# EAGLE design Power-PCB (EAGLE 7.7.0)
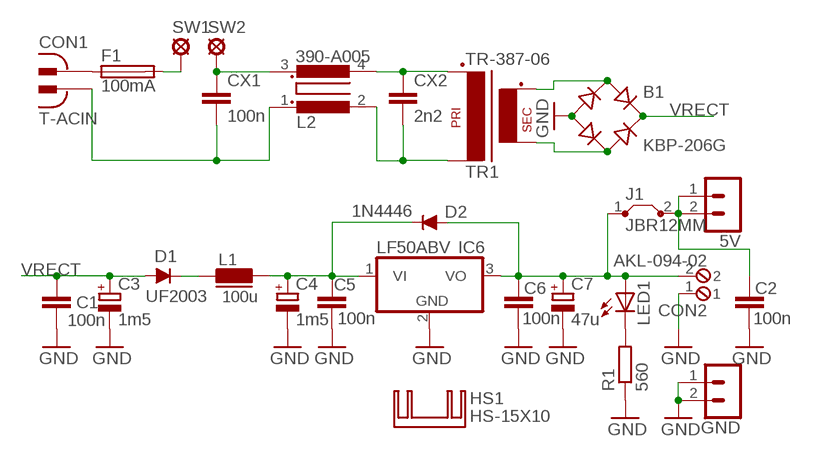
[diagram p0: schematic, sheet 1]

## Parts
5V  MA02-1  [MA02-1]
B1  KBP-206G  RECTIFIER-2KBP  [2KBP]
C1  100n  C-EU050-024X044  [C050-024X044]
C2  100n  C-EU050-024X044  [C050-024X044]
C3  1m5  CPOL-EUE5-10.5  [E5-10,5]
C4  1m5  CPOL-EUE5-10.5  [E5-10,5]
C5  100n  C-EU050-024X044  [C050-024X044]
C6  100n  C-EU050-024X044  [C050-024X044]
C7  47u  CPOL-EUE2.5-6  [E2,5-6]
CON1  T-ACIN  [TECHNICS-ACIN1]
CON2  AKL-094-02  [AKL-094-02]
CX1  100n  CXXC15B6  [XC15B6]
CX2  2n2  C-EU075-032X103  [C075-032X103]
D1  UF2003  DIODE-DO41-10A  [DO41-10A]
D2  1N4446  [DO35-10]
F1  100mA  FUSEKS9V  [KS9V]
GND  MA02-1  [MA02-1]
HS1  HS-15X10  [HEATSINK-TO220-15X10X21]
IC6  LF50ABV  7805TV  [TO220V]
J1  JBR12MM  JUMPER-BRIGDE12MM  [12-THICK-WIRE]
L1  100u  07HCP  [07HCP]
L2  390-A005  [390-A005]
LED1  LED5MM  [LED5MM]
R1  560  R-EU_0207/10  [0207/10]
SW1  SE13  [SE13]
SW2  SE13  [SE13]
TR1  TR-387-06  [TRAFO-GERTH-387-06]

## Nets
GND: B1.- C1.2 C2.2 C3.- C4.- C5.2 C6.2 C7.- CON2.1 GND.1 GND.2 IC6.2(GND) R1.1
N$1: CON1.1 F1.1
N$2: CX1.1 L2.3 SW2.MP
N$3: CON1.2 CX1.2 L2.1
N$4: F1.2 SW1.MP
N$5 [Stromversorgung]: C4.+ C5.1 D2.C IC6.1(VI) L1.2
N$6: CX2.1 L2.4 TR1.P2
N$7: CX2.2 L2.2 TR1.P1
N$8: B1.AC1 TR1.S2
N$9: B1.AC2 TR1.S1
N$10: LED1.K(C) R1.2
N$11: D1.C L1.1
N$12: C6.1 C7.+ CON2.2 D2.A IC6.3(VO) J1.1 LED1.A
N$13: 5V.1 5V.2 C2.1 J1.2
VRECT: B1.+ C1.1 C3.+ D1.A

## Library data of the parts
5V GND = tj-library:MA02-1: PIN HEADER
B1 = rectifier:RECTIFIER-: Rectifier
C1 C2 C5 C6 CX2 = rcl:C-EU: CAPACITOR, European symbol
C3 C4 C7 = rcl:CPOL-EU: POLARIZED CAPACITOR, European symbol
CON1 = tj-library:T-ACIN: TECHNICS AC Power Connector (ex. ST-G570)
CON2 = tj-library:AKL-094-02: Riacon AKL-094, Raster 5.08 mm, Polzahl 2
CX1 = rcl:CX: X CAPACITOR for power line
D1 = diode:DIODE-: DIODE
D2 = diode:1N4446: DIODE high speed (Philips)
F1 = fuse:FUSE: Fuse; OC_FARNELL: unknown; OC_NEWARK: unknown
HS1 = tj-library:HS-15X10: Heat Sink TO-220 (China, B:15mm x T:10mm x H:21mm)
IC6 = linear:78*: Positive VOLTAGE REGULATOR Source: http://cache.national.com/ds/LM/LM78L05.pdf http://www.fairchildsemi.com/ds/LM/LM7805.pdf
J1 = tj-library:JUMPER-BRIGDE: Bridge for thick wire (up to 1.35mm)
L1 = inductor-fastron:07HCP: Fastron Inductor 07HCP
L2 = tj-library:390-A005: Common Mode Choke (Ex switching Power Supply, 6...10mH, ca. 400mA)
LED1 = led:LED: LED OSRAM: - CHIPLED LG R971, LG N971, LY N971, LG Q971, LY Q971, LO R971, LY R971 LH N974, LH R974 LS Q976, LO Q976, LY Q976 LO Q996 - Hyper CHIPLED LW Q18S LB Q993, LB Q99A, LB R99A - SideLED LS A670, LO A670, LY A670, LG A670, LP A670 LB A673, LV A673, LT A673, LW A673 LH A674 LY A675 LS A676, LA A676, LO A676, LY A676, LW A676 LS A679, LY A679, LG A679 - Hyper Micro SIDELED® LS Y876, LA Y876, LO Y876, LY Y876 LT Y87S - SmartLED LW L88C, LW L88S LB L89C, LB L89S, LG L890 LS L89K, LO L89K, LY L89K LS L896, LA L896, LO L896, LY L896 - TOPLED LS T670, LO T670, LY T670, LG T670, LP T670 LSG T670, LSP T670, LSY T670, LOP T670, LYG T670 LG T671, LOG T671, LSG T671 LB T673, LV T673, LT T673, LW T673 LH T674 LS T676, LA T676, LO T676, LY T676, LB T676, LH T676, LSB T676, LW T676 LB T67C, LV T67C, LT T67C, LS T67K, LO T67K, LY T67K, LW E67C LS E67B, LA E67B, LO E67B, LY E67B, LB E67C, LV E67C, LT E67C LW T67C LS T679, LY T679, LG T679 LS T770, LO T770, LY T770, LG T770, LP T770 LB T773, LV T773, LT T773, LW T773 LH T774 LS E675, LA E675, LY E675, LS T675 LS T776, LA T776, LO T776, LY T776, LB T776 LHGB T686 LT T68C, LB T68C - Hyper Mini TOPLED® LB M676 - Mini TOPLED Santana® LG M470 LS M47K, LO M47K, LY M47K Source: http://www.osram.convergy.de LUXEON: - LUMILED® LXK2-PW12-R00, LXK2-PW12-S00, LXK2-PW14-U00, LXK2-PW14-V00 LXK2-PM12-R00, LXK2-PM12-S00, LXK2-PM14-U00 LXK2-PE12-Q00, LXK2-PE12-R00, LXK2-PE12-S00, LXK2-PE14-T00, LXK2-PE14-U00 LXK2-PB12-K00, LXK2-PB12-L00, LXK2-PB12-M00, LXK2-PB14-N00, LXK2-PB14-P00, LXK2-PB14-Q00 LXK2-PR12-L00, LXK2-PR12-M00, LXK2-PR14-Q00, LXK2-PR14-R00 LXK2-PD12-Q00, LXK2-PD12-R00, LXK2-PD12-S00 LXK2-PH12-R00, LXK2-PH12-S00 LXK2-PL12-P00, LXK2-PL12-Q00, LXK2-PL12-R00 Source: www.luxeon.com KINGBRIGHT: KA-3528ASYC Source: www.kingbright.com
R1 = rcl:R-EU_: RESISTOR, European symbol
SW1 SW2 = solpad:SE13: SOLDER PAD E1542, drill 1,3mm, distributor Buerklin, 07F815
TR1 = tj-library:TR-387-06: Transformator Gerth 387.06, 3.6VA

## Net classes
0 default: width 0.406 mm, clearance 0.406 mm
1 Stromversorgung: width 0.406 mm, clearance 0.406 mm
2 Stromversorgung 2: width 1.422 mm, clearance 0.61 mm

## Board
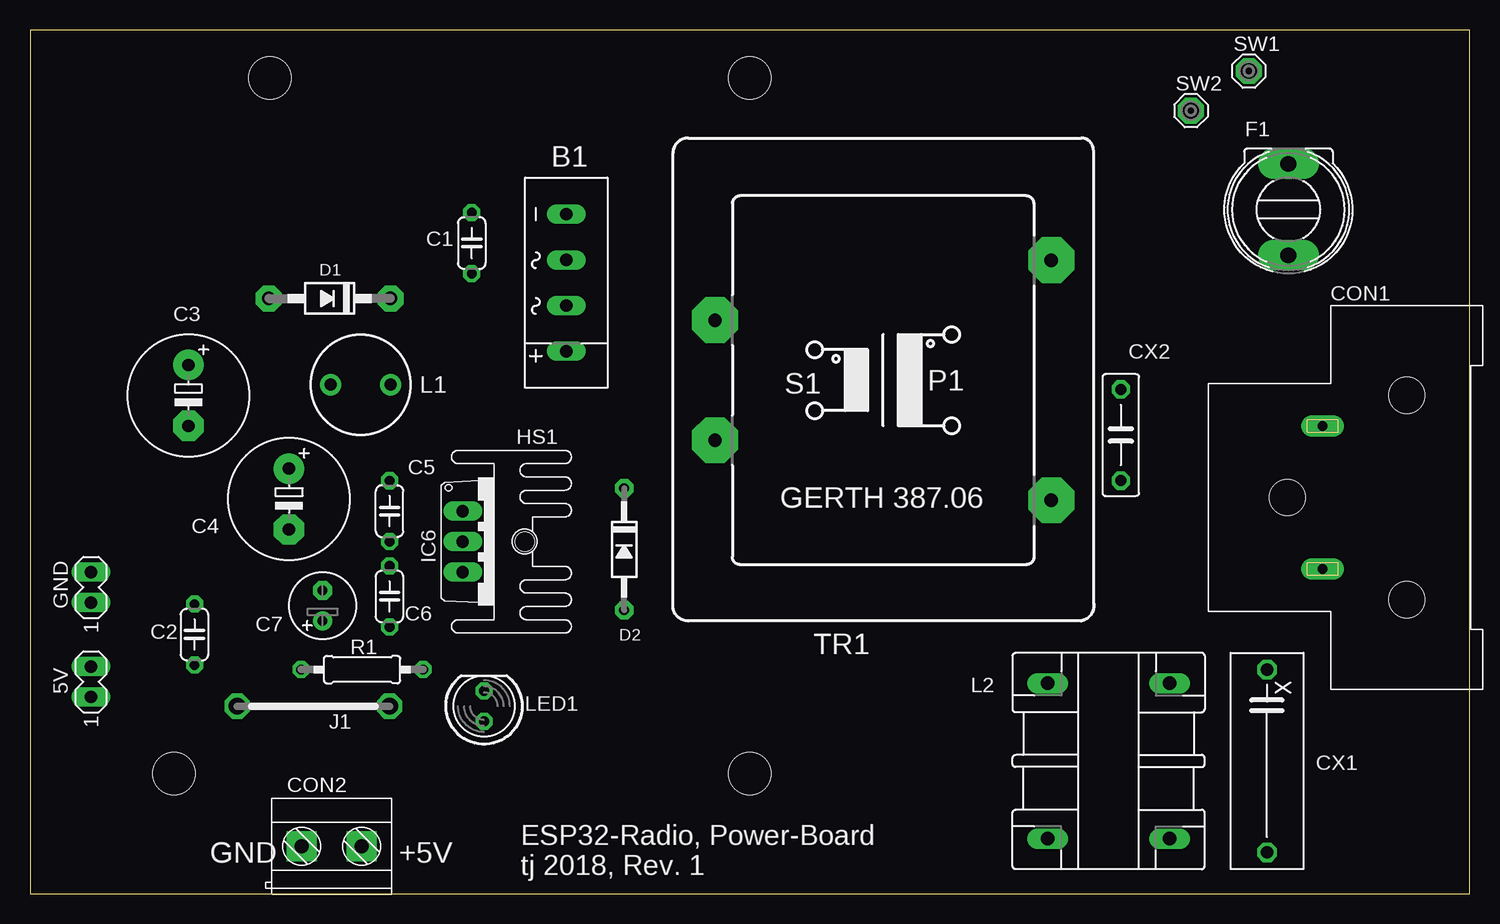
[diagram p1: board, top side]
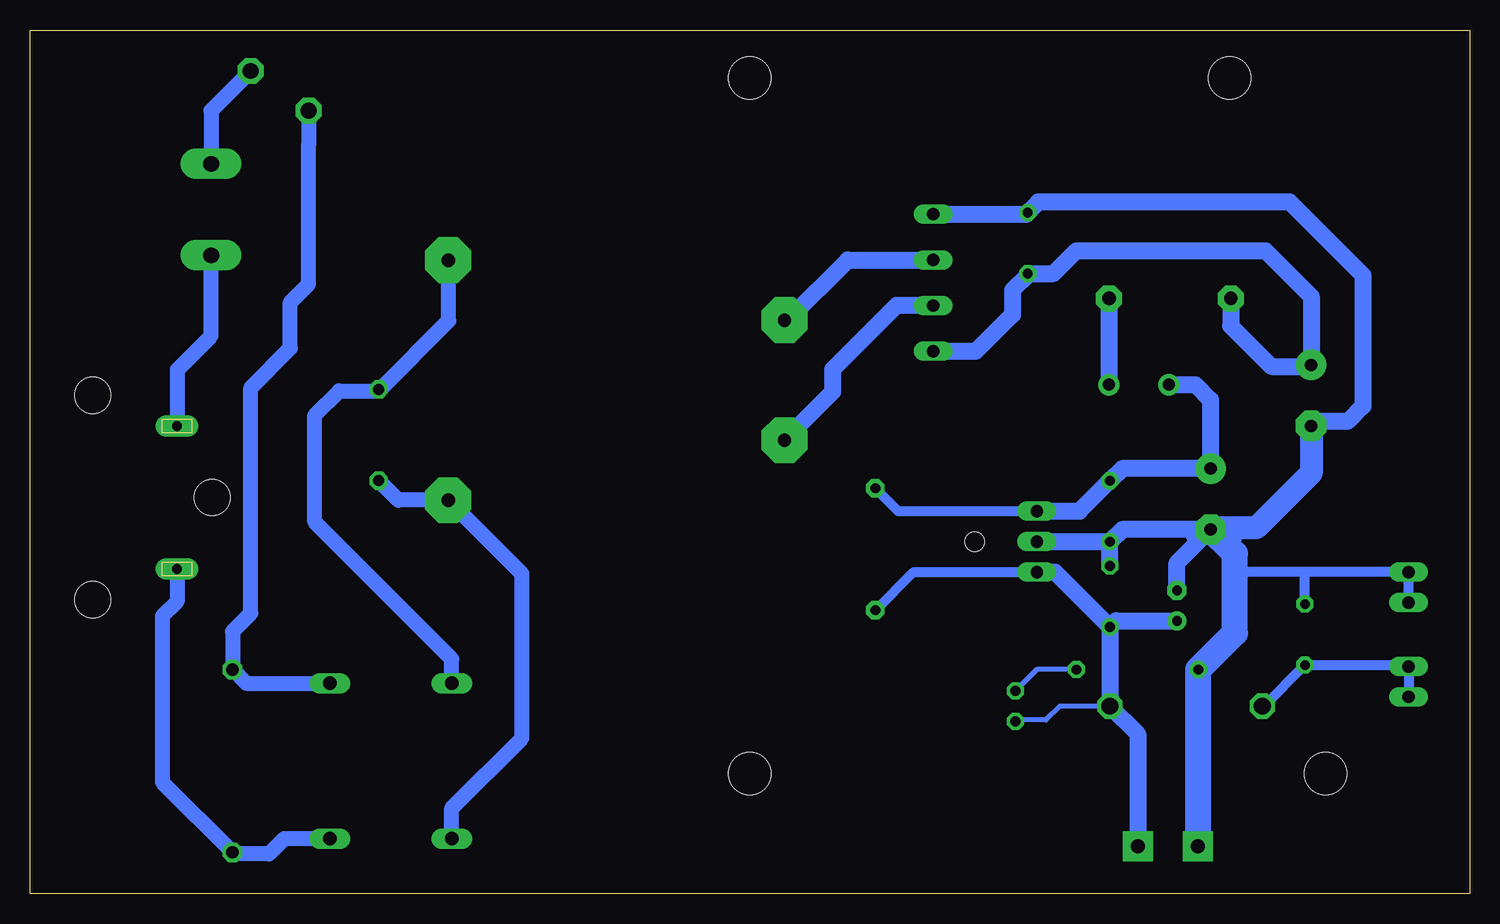
[diagram p2: board, bottom side, seen from below]

Size 120 x 72 mm. Coordinates in mm from the lower left corner, seen from the top.
Outline: 0,0 120,0 120,72 0,72 0,0
Copper layers (1*16): Top 0.035mm / dielectric 1.5mm / Bottom 0.035mm
Design rules "default *": minimum track width 10mil, minimum drill 24mil, track to track 8mil, track to pad 8mil, pad to pad 8mil, via to via 8mil, smd to smd 8mil, copper to edge 16mil, drill to drill 8mil, minimum pad ring 12mil, minimum via ring 10mil, stop-mask expansion 4mil, vias tented up to drill 0mil, thermal gap 10mil
Holes 3.5 mm at 20,68 60,68 12,10 60,10
tRestrict: area 18.2,66.2 to 21.8,69.8; area 58.2,66.2 to 61.8,69.8; area 10.2,8.2 to 13.8,11.8; area 58.2,8.2 to 61.8,11.8
bRestrict: area 18.2,66.2 to 21.8,69.8; area 58.2,66.2 to 61.8,69.8; area 10.2,8.2 to 13.8,11.8; area 58.2,8.2 to 61.8,11.8
vRestrict: area 18.2,66.2 to 21.8,69.8; area 58.2,66.2 to 61.8,69.8; area 10.2,8.2 to 13.8,11.8; area 58.2,8.2 to 61.8,11.8

### Footprints (pad centres in the part's own frame; a part is rotated, then mirrored left to right if it is on the bottom)
MA02-1 = drill 1.016 long: 1 -1.27,0; 2 1.27,0
2KBP = drill 1.016 long: + 5.715,0; - -5.715,0; AC1 -1.905,0; AC2 1.905,0
C050-024X044 = drill 0.813 octagon: 1 -2.54,0; 2 2.54,0
E5-10,5 = drill 1.016 pad 2.54: + -2.54,0 | drill 1.016 pad 2.54 octagon: - 2.54,0
E2,5-6 = drill 0.813 pad 1.6: + -1.27,0 | drill 0.813 pad 1.6 octagon: - 1.27,0
TECHNICS-ACIN1 = drill 0.813 pad 1.778 long: 1 -5.961,-1.27; 2 5.945,-1.27 | hole 3: 0,-4.21; 8.52,5.75; -8.52,5.75
AKL-094-02 = drill 1.2 pad 2.54 square: 1 -2.5,0; 2 2.5,0
XC15B6 = drill 1.016 octagon: 1 -7.62,0; 2 7.62,0
C075-032X103 = drill 0.914 octagon: 1 -3.81,0; 2 3.81,0
DO41-10A = drill 1.118 pad 2.184 octagon: A 5.08,0; C -5.08,0
DO35-10 = drill 0.813 pad 1.524 octagon: A 5.08,0; C -5.08,0
KS9V = drill 1.321 pad 2.54 long: 1 0,3.81; 2 0,-3.81
HEATSINK-TO220-15X10X21 = hole 1.6: 0,1.111
TO220V = drill 1.016 long: 1 -2.54,-2.54; 2 0,-2.54; 3 2.54,-2.54
12-THICK-WIRE = drill 1.4 octagon: 1 -6.35,0; 2 6.35,0
07HCP = drill 1 pad 1.778: 1 -2.5,0; 2 2.5,0
390-A005 = drill 1.118 long: 1 -6.477,-5.08; 2 -6.477,5.08; 3 6.477,-5.08; 4 6.477,5.08
LED5MM = drill 0.813 octagon: A -1.27,0; K 1.27,0
0207/10 = drill 0.813 octagon: 1 -5.08,0; 2 5.08,0
SE13 = drill 1.321 pad 2.159 octagon: MP 0,0
TRAFO-GERTH-387-06 = drill 1.118 pad 3.81 octagon: P1 -14.017,10.008; P2 -14.017,-10.008; S1 14.017,5.004; S2 14.017,-5.004

### Placement (x,y rotation side)
5V  5.08,17.65 90 top
B1  44.7,50.93 270 top
C1  36.83,54.23 90 top
C2  13.72,21.59 90 top
C3  13.21,41.53 270 top
C4  21.59,32.89 270 top
C5  29.97,31.88 270 top
C6  29.97,24.77 90 top
C7  24.38,24 90 top
CON1  109.02,33.02 270 top
CON2  25.15,3.94 0 top
CX1  103.12,11.05 270 top
CX2  90.93,38.23 270 top
D1  24.98,49.61 180 top
D2  49.53,28.7 270 top
F1  104.9,57.02 180 top
GND  5.08,25.53 90 top
HS1  40.13,29.34 270 top
IC6  38.61,29.34 270 top
J1  23.62,15.62 180 top
L1  27.56,42.42 180 top
L2  89.92,11.05 90 top
LED1  37.85,15.62 90 top
R1  27.69,18.67 0 top
SW1  101.6,68.58 0 top
SW2  96.77,65.28 0 top
TR1  71.12,42.8 180 top

### Tracks (layer width: path | path; a pad name or v marks a point on that pad's centre or on a via)
GND
  Bottom 0.406: 23.11,29.21 22.86,29.21 22.8,29.15 | 19.05,29.97 19.3,29.21 19.3,28.96 19.75,28.51
  Bottom 0.61: 23.62,30.23 23.11,29.21
  Bottom 0.813: GND.1 GND.2 13.72,26.8 | 13.72,26.8 19.43,26.8 19.56,26.67 | C2.2 13.72,26.8
  Bottom 1.422: B1.- 36.96,56.64 C1.2 35.94,57.66 14.99,57.66 8.89,51.56 8.89,40.64 10.16,39.37 12.83,39.37 C3.- | IC6.2 C5.2 | C6.2 C5.2 | C5.2 28.96,30.35 C4.- 22.8,29.15 24.38,27.56 C7.- | CON2.1 22.61,3.98
  Bottom 1.93: C3.- 13.21,35.05 17.78,30.48 21.46,30.48 C4.-
  Bottom 2.184: 22.61,3.98 R1.1 19.56,21.72 19.56,26.67 19.56,28.32 19.75,28.51 C4.-
N$1
  Bottom 1.27: CON1.1 107.7,38.98 107.7,43.69 104.9,46.48 F1.1
N$2
  Bottom 1.27: L2.3 101.98,17.53 CX1.1 103.12,21.84 101.6,23.37 101.6,42.16 98.3,45.47 98.3,49.28 96.77,50.8 96.77,61.72 96.77,62.36 SW2.MP
N$3
  Bottom 1.27: CON1.2 107.75,24.33 108.97,23.11 108.97,9.27 CX1.2 103,3.3 100.08,3.3 98.81,4.57 L2.1
N$4
  Bottom 1.27: F1.2 104.9,65.28 104.78,65.41 104.52,65.66 SW1.MP
N$5
  Bottom 0.813: D2.C 47.63,31.88 IC6.1
  Bottom 1.422: L1.2 22.86,42.42 21.59,41.15 C4.+ 28.96,35.43 C5.1 32.51,31.88 IC6.1
N$6
  Bottom 1.27: L2.4 84.84,19.56 96.27,30.99 96.27,39.88 94.23,41.91 91.06,41.91 CX2.1 90.8,42.04 85.09,47.75 85.09,52.76 TR1.P2
N$7
  Bottom 1.27: L2.2 84.84,7.11 78.99,12.95 78.99,26.65 TR1.P1 89.31,32.79 CX2.2
N$8
  Bottom 1.422: TR1.S2 56.84,47.8 51.82,52.83 B1.AC1
N$9
  Bottom 1.422: B1.AC2 47.75,49.02 53.09,43.69 53.09,41.81 TR1.S1
N$10
  Bottom 0.406: R1.2 36.07,18.67 LED1.K
N$11
  Bottom 1.422: D1.C L1.1
N$12
  Bottom 0.406: J1.1 34.16,15.62 35.31,14.48 37.72,14.48 LED1.A
  Bottom 0.813: D2.A 46.35,26.8 IC6.3
  Bottom 1.422: IC6.3 34.54,26.8 C6.1 | C6.1 29.46,22.73 C7.+ | C6.1 J1.1 27.65,13.3 CON2.2
N$13
  Bottom 0.813: 5V.1 5V.2 5.21,19.05 C2.1 17.14,15.62 J1.2
VRECT
  Bottom 1.422: D1.A 19.9,47.33 16.51,43.94 13.34,43.94 C3.+ 13.21,49.78 17.02,53.59 32.77,53.59 34.67,51.69 C1.1 36.83,51.56 38.1,50.29 38.1,48.26 41.15,45.21 B1.+

### Text on the board
tPlace: GND | +5V | ESP32-Radio, Power-Board / tj 2018, Rev. 1